# Altium schematic sheet Filtre passe-bande 5k.SchDoc
size A4; SheetNumber: 3; SheetTotal: 4; SPICEModelCacheENHUJXAW: <root> / <DocumentId>ENHUJXAW</DocumentId> / <CacheFrame Number="0"> / <Model Name="ideal" Kind="CKT"> / <Text>*IDEAL:Amplificateur operationnel avec gain boucle ouverte de 100K / .SUBCKT IDEAL 1 2 3 / EGAIN 3 0 1 2 1E5 / .ENDS</Text> / </Model> / </CacheFrame> / </root>
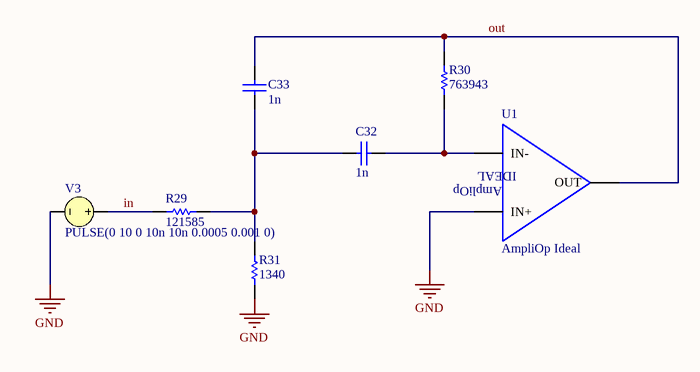
[diagram p0: Filtre passe-bande 5k.SchDoc]

## Parts
C32  value 1n  (hidden comment: Capacitor)
C33  value 1n  (hidden comment: Capacitor)
R29  value 121585  (hidden comment: Resistor)
R30  value 763943  (hidden comment: Resistor)
R31  value 1340  (hidden comment: Resistor)
U1  AmpliOp Ideal
V3  PULSE(0 10 0 10n 10n 0.0005 0.001 0)

## Nets
GND: R31.2 U1.1(IN+) V3.2
in: R29.2 V3.1
out: C33.2 R30.2 U1.3(OUT)
NetC32_1: C32.1 C33.1 R29.1 R31.1
NetC32_2: C32.2 R30.1 U1.2(IN-)

## Notes on the sheet
- (in symbol AmpliOp_ideal) IDEAL; AmpliOp

## Library data of the parts
C32 C33 = Capacitor: SimulationGenericComponent: True
R29-R31 = Resistor: TC1: 0; SimulationGenericComponent: True; TC2: 0
U1 = AmpliOp_ideal
V3 = VSRC: Voltage Source; Note: PCB Footprint - Not required; AC Magnitude: 0; Pulsed Value: 10; Pulse Width: 0.0005; Period: 0.001; Published: 8-Jun-2000; LatestRevisionDate: 17-Jul-2002; LatestRevisionNote: Re-released for DXP Platform.; PackageReference: Not Applicable; Publisher: Altium Limited; AC Phase: 0; DC Magnitude: 0; Initial Value: 0; Time Delay: 0; Rise Time: 10n; Fall Time: 10n; Phase: 0